# Altium project Flipper_ETH.PrjPcb
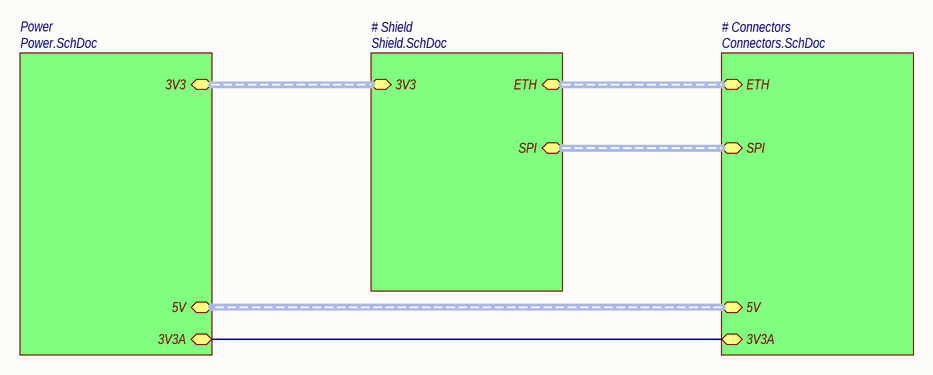
[diagram p0: Main.SchDoc]
4 sheets, 53 parts. Net scope: hierarchical (ports join the sheet entries above them; power ports are global).
Sheets:
  Main.SchDoc
    # Connectors = Connectors.SchDoc
    # Shield = Shield.SchDoc
    Power = Power.SchDoc

## Sheet Main.SchDoc
size A4

### Sub-sheets
# Connectors = Connectors.SchDoc: ETH (harness ETH), SPI (harness SPI), 5V (harness Power_5V0), 3V3A
# Shield = Shield.SchDoc: ETH (harness ETH), SPI (harness SPI), 3V3 (harness Power_3V3)
Power = Power.SchDoc: 3V3 (harness Power_3V3), 5V (harness Power_5V0), 3V3A

### Nets
3V3A: sheet # Connectors/3V3A, sheet Power/3V3A

### Buses and harness runs
harness sheet # Connectors/5V = sheet Power/5V
harness sheet # Connectors/ETH = sheet # Shield/ETH
harness sheet # Connectors/SPI = sheet # Shield/SPI
harness sheet # Shield/3V3 = sheet Power/3V3

### Notes on the sheet
- Title
- Size:
- Date:
- A4
- Number:
- Time:
- Revision:
- Sheet
- of
- File:

## Sheet Connectors.SchDoc
size A4; DrawnBy: sht4; DocumentCode: Децимальный номер; SchemeType: Схема электрическая принципиальная; PageSetup: Record=PageOptionsZCenterHorizontal=TrueZCenterVertical=TrueZPrintScale=0.95ZXCorrection=1.00ZYCorrection=1.00ZPrintKind=2ZBorderSize=5000000ZLeftOffset=0ZBottomOffset=0ZOrientation=1ZPaperLength=1000ZPaperWidth=1000ZScale=100ZPaperSource=7ZPrintQuality=600ZMediaType=1ZDitherType=10ZPaperKind=A4 (210 x 297 мм)ZPrintScaleMode=1; Rule: PcbType=ProtelPcb; Rule: UNIONINDEX{}0[]RULEKIND{}Clearance[]NETSCOPE{}DifferentNets[]LAYERKIND{}SameLayer[]NAME{}Schematic Clearance Constraint[]GAP{}10mil[]GENERICCLEARANCE{}10mil[]IGNOREPADTOPADCLEARANCEINFOOTPRINT{}FALSE[]OBJECTCLEARANCES{}ClearanceObj_Arc-ClearanceObj_Hole:0;ClearanceObj_Track-ClearanceObj_Hole:0;ClearanceObj_SMDPad-ClearanceObj_Hole:0;ClearanceObj_THPad-ClearanceObj_Hole:0;ClearanceObj_Via-ClearanceObj_Hole:0;ClearanceObj_Fill-ClearanceObj_Hole:0;ClearanceObj_Poly-ClearanceObj_Hole:0;ClearanceObj_Region-ClearanceObj_Hole:0;ClearanceObj_Text-ClearanceObj_Hole:0[]UNIT{}Metric[]PcbType{}ProtelPcb
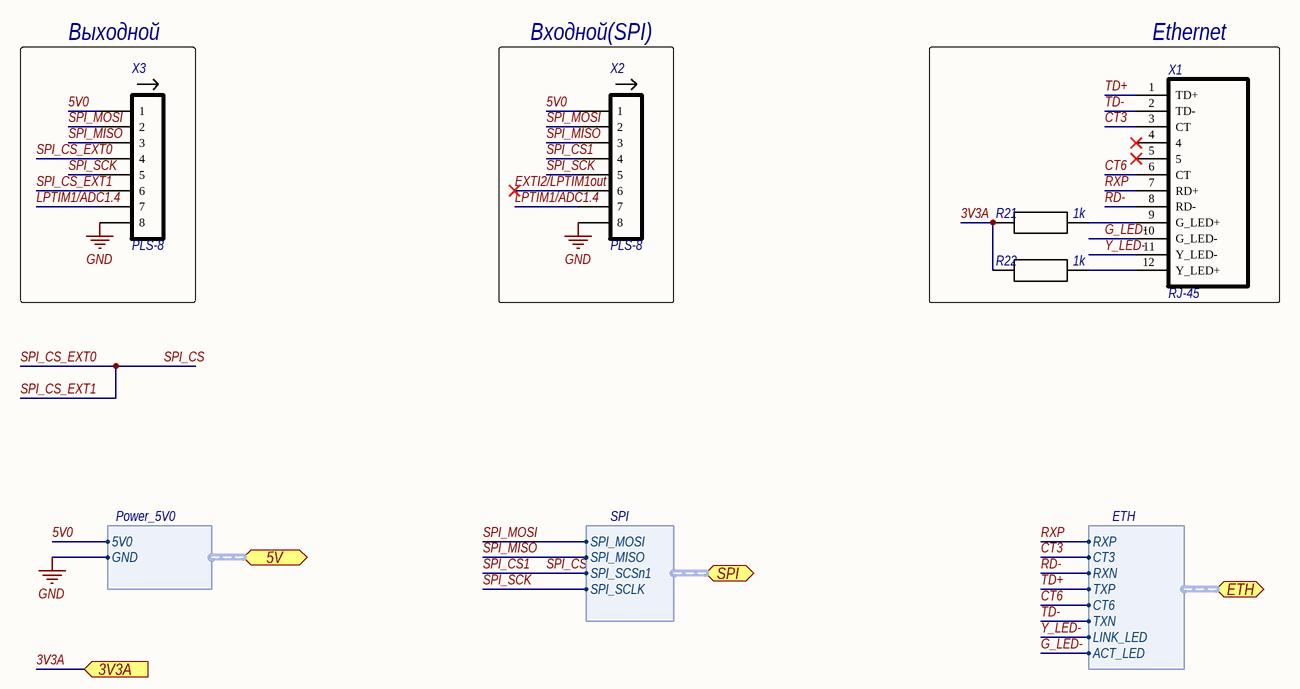
[diagram p1: Connectors.SchDoc]

### Parts
R21  1k
R22  1k
X1  RJ-45
X2  PLS-8  [B8B-PH-K-S(LF)(SN)]
X3  PLS-8  [B8B-PH-K-S(LF)(SN)]

### Blocks framed on the sheet
Выходной: X3
Входной(SPI): X2
Ethernet: R21 R22 X1

### Ports
3V3A, 5V (harness Power_5V0), ETH (harness ETH), SPI (harness SPI)

### Harnesses
ETH: RXP, RXN, TXP, TXN, CT3, CT6, ACT_LED, LINK_LED
SPI: SPI_MOSI, SPI_MISO, SPI_SCSn1, SPI_SCLK
Power_5V0: 5V0, GND

### Nets
GND: X2.8 X3.8 ; port 5V.GND
3V3A: R21.2 R22.2 ; port 3V3A
5V0: X2.1 X3.1 ; port 5V.5V0
CT3: X1.3(CT) ; port ETH.CT3
CT6: X1.6(CT) ; port ETH.CT6
EXTI2/LPTIM1out: X2.6
G_LED-: X1.10(G_LED-) ; port ETH.ACT_LED  [project net ACT_LED]
LPTIM1/ADC1.4: X2.7 X3.7
RD-: X1.8(RD-) ; port ETH.RXN
RXP: X1.7(RD+) ; port ETH.RXP
SPI_CS: X2.4 X3.4 X3.6 ; port SPI.SPI_SCSn1  [also labelled SPI_CS1, SPI_CS_EXT0, SPI_CS_EXT1]  [project net SCSn1]
SPI_MISO: X2.3 X3.3 ; port SPI.SPI_MISO  [project net MISO]
SPI_MOSI: X2.2 X3.2 ; port SPI.SPI_MOSI  [project net MOSI]
SPI_SCK: X2.5 X3.5 ; port SPI.SPI_SCLK  [project net 3V3D]
TD+: X1.1(TD+) ; port ETH.TXP
TD-: X1.2(TD-) ; port ETH.TXN
Y_LED-: X1.11(Y_LED-) ; port ETH.LINK_LED  [project net LINK_LED]
NetR21_1: R21.1 X1.9(G_LED+)
NetR22_1: R22.1 X1.12(Y_LED+)

Not connected (* = marked no-connect by the designer): X1 4* 5*

### Notes on the sheet
- Title
- Size:
- Date:
- A4
- Number:
- Time:
- Revision:
- Sheet
- of
- File:

### Library data of the parts
R21 R22 = Resistor
X2 X3 = 8-pin plug

## Sheet Shield.SchDoc
size A4
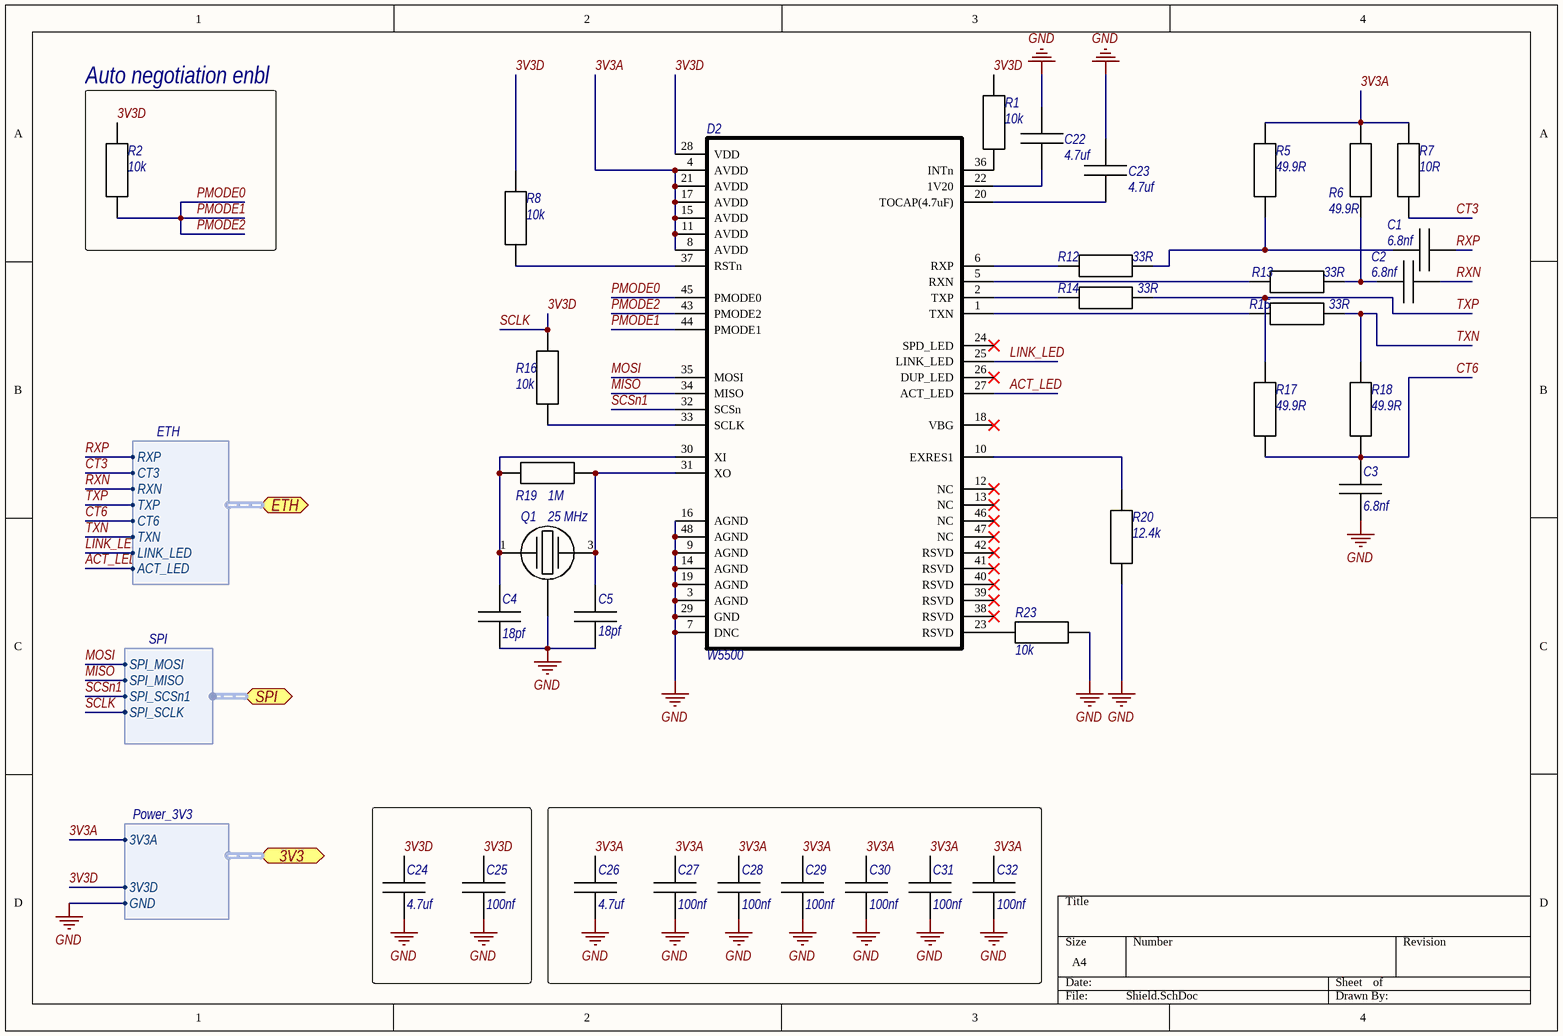
[diagram p2: Shield.SchDoc]

### Parts
C1  6.8nf
C2  6.8nf
C3  6.8nf
C4  18pf
C5  18pf
C22  4.7uf
C23  4.7uf
C24  4.7uf
C25  100nf
C26  4.7uf
C27  100nf
C28  100nf
C29  100nf
C30  100nf
C31  100nf
C32  100nf
D2  W5500  [LQFP-48 7.0 x 7.0 x 1.6]
Q1  25 MHz
R1  10k
R2  10k
R5  49.9R
R6  49.9R
R7  10R
R8  10k
R12  33R
R13  33R
R14  33R
R15  33R
R16  10k
R17  49.9R
R18  49.9R
R19  1M
R20  12.4k
R23  10k

### Blocks framed on the sheet
Auto negotiation enbl: R2

### Ports
3V3 (harness Power_3V3), ETH (harness ETH), SPI (harness SPI)

### Harnesses
ETH: RXP, RXN, TXP, TXN, CT3, CT6, ACT_LED, LINK_LED
SPI: SPI_MOSI, SPI_MISO, SPI_SCSn1, SPI_SCLK
Power_3V3: 3V3A, GND, 3V3D

### Nets
GND: C3.1 C4.1 C5.1 C22.1 C23.1 C24.1 C25.1 C26.1 C27.1 C28.1 C29.1 C30.1 C31.1 C32.1 D2.3(AGND) D2.7(DNC) D2.9(AGND) D2.14(AGND) D2.16(AGND) D2.19(AGND) D2.29(GND) D2.48(AGND) Q1.2 Q1.4 R20.1 R23.1 ; port 3V3.GND
3V3A: C26.2 C27.2 C28.2 C29.2 C30.2 C31.2 C32.2 D2.4(AVDD) D2.8(AVDD) D2.11(AVDD) D2.15(AVDD) D2.17(AVDD) D2.21(AVDD) R5.1 R6.1 R7.1 ; port 3V3.3V3A
3V3D: C24.2 C25.2 D2.28(VDD) R1.2 R2.2 R8.2 R16.1 ; port SPI.SPI_SCLK, port 3V3.3V3D  [also labelled SCLK]
ACT_LED: D2.27(ACT_LED) ; port ETH.ACT_LED
CT3: R7.2 ; port ETH.CT3
CT6: C3.2 R17.2 R18.2 ; port ETH.CT6
LINK_LED: D2.25(LINK_LED) ; port ETH.LINK_LED
MISO: D2.34(MISO) ; port SPI.SPI_MISO
MOSI: D2.35(MOSI) ; port SPI.SPI_MOSI
PMODE0: D2.43(PMODE2) D2.44(PMODE1) D2.45(PMODE0) R2.1  [also labelled PMODE1, PMODE2]
RXN: C2.1 ; port ETH.RXN  [project net RD-]
RXP: C1.1 ; port ETH.RXP
SCSn1: D2.32(SCSn) ; port SPI.SPI_SCSn1
TXN: R15.1 R18.1 ; port ETH.TXN  [project net TD-]
TXP: R14.1 R17.1 ; port ETH.TXP  [project net TD+]
NetC1_2: C1.2 R5.2 R12.1
NetC2_2: C2.2 R6.2 R13.1
NetC4_2: C4.2 D2.30(XI) Q1.1 R19.2
NetC5_2: C5.2 D2.31(XO) Q1.3 R19.1
NetC22_2: C22.2 D2.22(1V20)
NetC23_2: C23.2 D2.20(TOCAP(4.7uF))
NetD2_1: D2.1(TXN) R15.2
NetD2_2: D2.2(TXP) R14.2
NetD2_5: D2.5(RXN) R13.2
NetD2_6: D2.6(RXP) R12.2
NetD2_10: D2.10(EXRES1) R20.2
NetD2_23: D2.23(RSVD) R23.2
NetD2_33: D2.33(SCLK) R16.2
NetD2_36: D2.36(INTn) R1.1
NetD2_37: D2.37(RSTn) R8.1

Not connected (* = marked no-connect by the designer): D2 12(NC)* 13(NC)* 18(VBG)* 24(SPD_LED)* 26(DUP_LED)* 38(RSVD)* 39(RSVD)* 40(RSVD)* 41(RSVD)* 42(RSVD)* 46(NC)* 47(NC)*

### Library data of the parts
C1-C5 C22-C32 = Capacitor
Q1 = Oscillator
R1 R2 R5-R8 R12-R20 R23 = Resistor

## Sheet Power.SchDoc
size A4
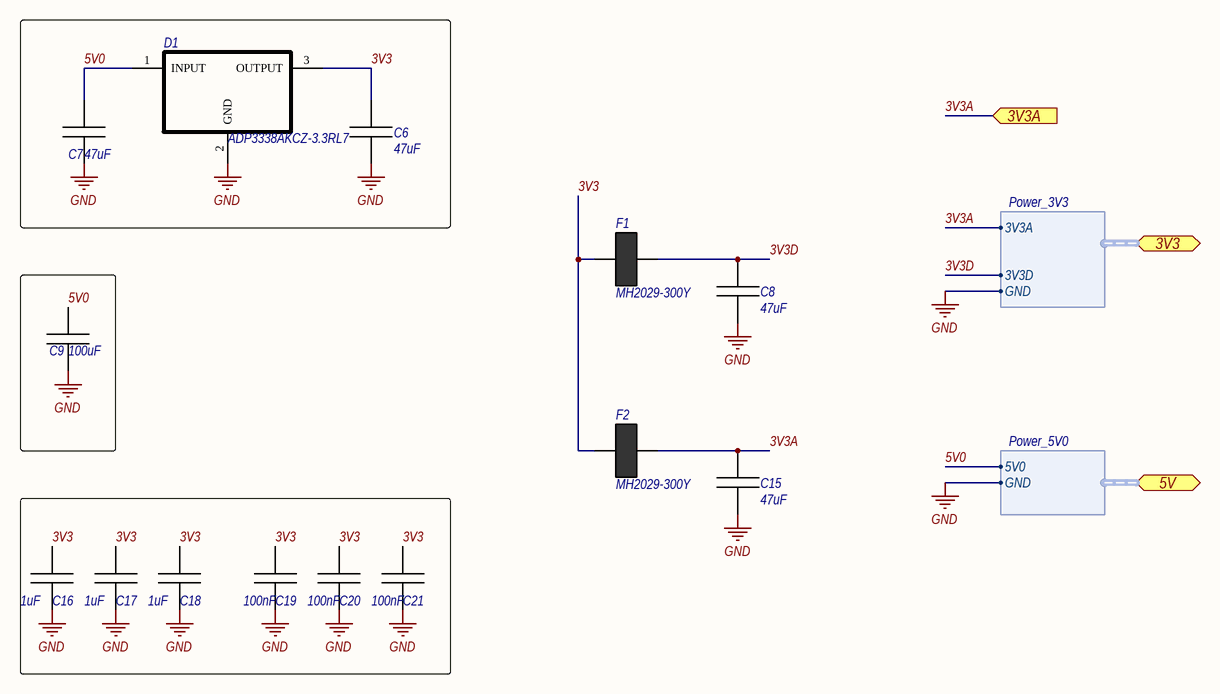
[diagram p3: Power.SchDoc]

### Parts
C6  47uF
C7  47uF
C8  47uF
C9  100uF
C15  47uF
C16  1uF
C17  1uF
C18  1uF
C19  100nF
C20  100nF
C21  100nF
D1  ADP3338AKCZ-3.3RL7
F1  MH2029-300Y
F2  MH2029-300Y

### Ports
3V3 (harness Power_3V3), 3V3A, 5V (harness Power_5V0)

### Harnesses
Power_5V0: 5V0, GND
Power_3V3: 3V3A, GND, 3V3D

### Nets
GND: C6.1 C7.1 C8.1 C9.1 C15.1 C16.1 C17.1 C18.1 C19.1 C20.1 C21.1 D1.2(GND) ; port 5V.GND, port 3V3.GND
3V3: C6.2 C16.2 C17.2 C18.2 C19.2 C20.2 C21.2 D1.3(OUTPUT) F1.1 F2.1
3V3A: C15.2 F2.2 ; port 3V3A, port 3V3.3V3A
3V3D: C8.2 F1.2 ; port 3V3.3V3D
5V0: C7.2 C9.2 D1.1(INPUT) ; port 5V.5V0

### Library data of the parts
C6-C9 C15-C21 = Capacitor
D1 = ADP3338AKCZ-3.3RL7: LDO
F1 F2 = Ferrite

## Nets that join several sheets
GND: Connectors (X2.8 X3.8), Shield (26 pins), Power (12 pins)
3V3A: Connectors (R21.2 R22.2), Shield (16 pins), Power (C15.2 F2.2)
3V3D: Connectors (X2.5 X3.5), Shield (7 pins), Power (C8.2 F1.2)
5V0: Connectors (X2.1 X3.1), Power (C7.2 C9.2 D1.1)
ACT_LED: Connectors (X1.10), Shield (D2.27)
CT3: Connectors (X1.3), Shield (R7.2)
CT6: Connectors (X1.6), Shield (C3.2 R17.2 R18.2)
LINK_LED: Connectors (X1.11), Shield (D2.25)
MISO: Connectors (X2.3 X3.3), Shield (D2.34)
MOSI: Connectors (X2.2 X3.2), Shield (D2.35)
RD-: Connectors (X1.8), Shield (C2.1)
RXP: Connectors (X1.7), Shield (C1.1)
SCSn1: Connectors (X2.4 X3.4 X3.6), Shield (D2.32)
TD+: Connectors (X1.1), Shield (R14.1 R17.1)
TD-: Connectors (X1.2), Shield (R15.1 R18.1)